# EAGLE design Receiver (EAGLE 7.1.0)
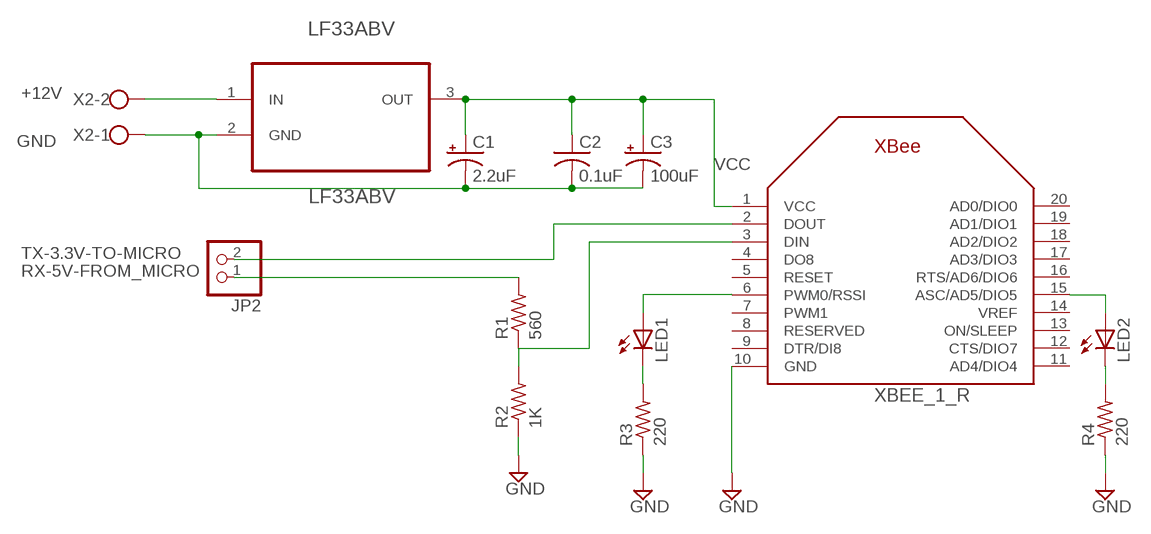
[diagram p0: schematic, sheet 1]

## Parts
C1  2.2uF  CAP_POLPTH2  [CPOL-RADIAL-10UF-25V]
C2  0.1uF  C-US025-024X044  [C025-024X044]
C3  100uF  CAP_POLPTH1  [CPOL-RADIAL-100UF-25V]
JP2  PINHD-1X2  [1X02]
LED1  LED5MM  [LED5MM]
LED2  LED5MM  [LED5MM]
LF33ABV  LF33ABV  [TO254P450X1020X1935-3P]
R1  560  R-US_0207/10  [0207/10]
R2  1K  R-US_0207/10  [0207/10]
R3  220  R-US_0207/10  [0207/10]
R4  220  R-US_0207/10  [0207/10]
X2  W237-102  [W237-102]
XBEE_1_R  XBEE  [XBEE]

## Nets
+12V [power]: LF33ABV.1(IN) X2.2
GND [power]: C1.2(-) C2.2 C3.2(-) LF33ABV.2(GND) R2.1 R3.1 R4.1 X2.1 XBEE_1_R.10(GND)
N$1: R1.1 R2.2 XBEE_1_R.3(DIN)
N$3: LED1.K(C) R3.2
N$5: LED2.A XBEE_1_R.15(ASC/AD5/DIO5)
N$6: LED2.K(C) R4.2
N$7: LED1.A XBEE_1_R.6(PWM0/RSSI)
RX-5V-FROM_MICRO: JP2.1 R1.2
TX-3.3V-TO-MICRO: JP2.2 XBEE_1_R.2(DOUT)
VCC [power]: C1.1(+) C2.1 C3.1(+) LF33ABV.3(OUT) XBEE_1_R.1(VCC)
Unconnected: XBEE_1_R.4(DO8) XBEE_1_R.5(RESET) XBEE_1_R.7(PWM1) XBEE_1_R.8(RESERVED) XBEE_1_R.9(DTR/DI8) XBEE_1_R.11(AD4/DIO4) XBEE_1_R.12(CTS/DIO7) XBEE_1_R.13(ON/SLEEP) XBEE_1_R.14(VREF) XBEE_1_R.16(RTS/AD6/DIO6) XBEE_1_R.17(AD3/DIO3) XBEE_1_R.18(AD2/DIO2) XBEE_1_R.19(AD1/DIO1) XBEE_1_R.20(AD0/DIO0)

## Library data of the parts
C1 C3 = SparkFun-Capacitors:CAP_POL: Capacitor Polarized These are standard SMD and PTH capacitors. Normally 10uF, 47uF, and 100uF in electrolytic and tantalum varieties. Always verify the external diameter of the through hole cap, it varies with capacity, voltage, and manufacturer. The EIA devices should be standard.
C2 = adafruit:C-US: CAPACITOR, American symbol
JP2 = pinhead:PINHD-1X2: PIN HEADER
LED1 LED2 = adafruit:LED: LED OSRAM: - CHIPLED LG R971, LG N971, LY N971, LG Q971, LY Q971, LO R971, LY R971 LH N974, LH R974 LS Q976, LO Q976, LY Q976 LO Q996 - Hyper CHIPLED LW Q18S LB Q993, LB Q99A, LB R99A - SideLED LS A670, LO A670, LY A670, LG A670, LP A670 LB A673, LV A673, LT A673, LW A673 LH A674 LY A675 LS A676, LA A676, LO A676, LY A676, LW A676 LS A679, LY A679, LG A679 - Hyper Micro SIDELED® LS Y876, LA Y876, LO Y876, LY Y876 LT Y87S - SmartLED LW L88C, LW L88S LB L89C, LB L89S, LG L890 LS L89K, LO L89K, LY L89K LS L896, LA L896, LO L896, LY L896 - TOPLED LS T670, LO T670, LY T670, LG T670, LP T670 LSG T670, LSP T670, LSY T670, LOP T670, LYG T670 LG T671, LOG T671, LSG T671 LB T673, LV T673, LT T673, LW T673 LH T674 LS T676, LA T676, LO T676, LY T676, LB T676, LH T676, LSB T676, LW T676 LB T67C, LV T67C, LT T67C, LS T67K, LO T67K, LY T67K, LW E67C LS E67B, LA E67B, LO E67B, LY E67B, LB E67C, LV E67C, LT E67C LW T67C LS T679, LY T679, LG T679 LS T770, LO T770, LY T770, LG T770, LP T770 LB T773, LV T773, LT T773, LW T773 LH T774 LS E675, LA E675, LY E675, LS T675 LS T776, LA T776, LO T776, LY T776, LB T776 LHGB T686 LT T68C, LB T68C - Hyper Mini TOPLED® LB M676 - Mini TOPLED Santana® LG M470 LS M47K, LO M47K, LY M47K Source: http://www.osram.convergy.de/
LF33ABV = ST Microelctronics_By_element14_Batch_1:LF33ABV: Very low drop voltage regulators with inhibit; MPN: LF33ABV; OC_FARNELL: 1087184; OC_NEWARK: 26M0228; PACKAGE: TO-220; SUPPLIER: STMicroelectronics
R1 R2 = adafruit:R-US_: RESISTOR, American symbol
R3 R4 = resistor:R-US_: RESISTOR, American symbol
X2 = con-wago-500:W237-102: WAGO SCREW CLAMP; MPN: 237-102; OC_FARNELL: unknown; OC_NEWARK: 70K9898
XBEE_1_R = adafruit:XBEE

## Net classes
0 signal: width 0.508 mm, drill 0.508 mm, clearance 0.381 mm
1 power: width 0.635 mm, drill 0.508 mm, clearance 0.559 mm

## Board
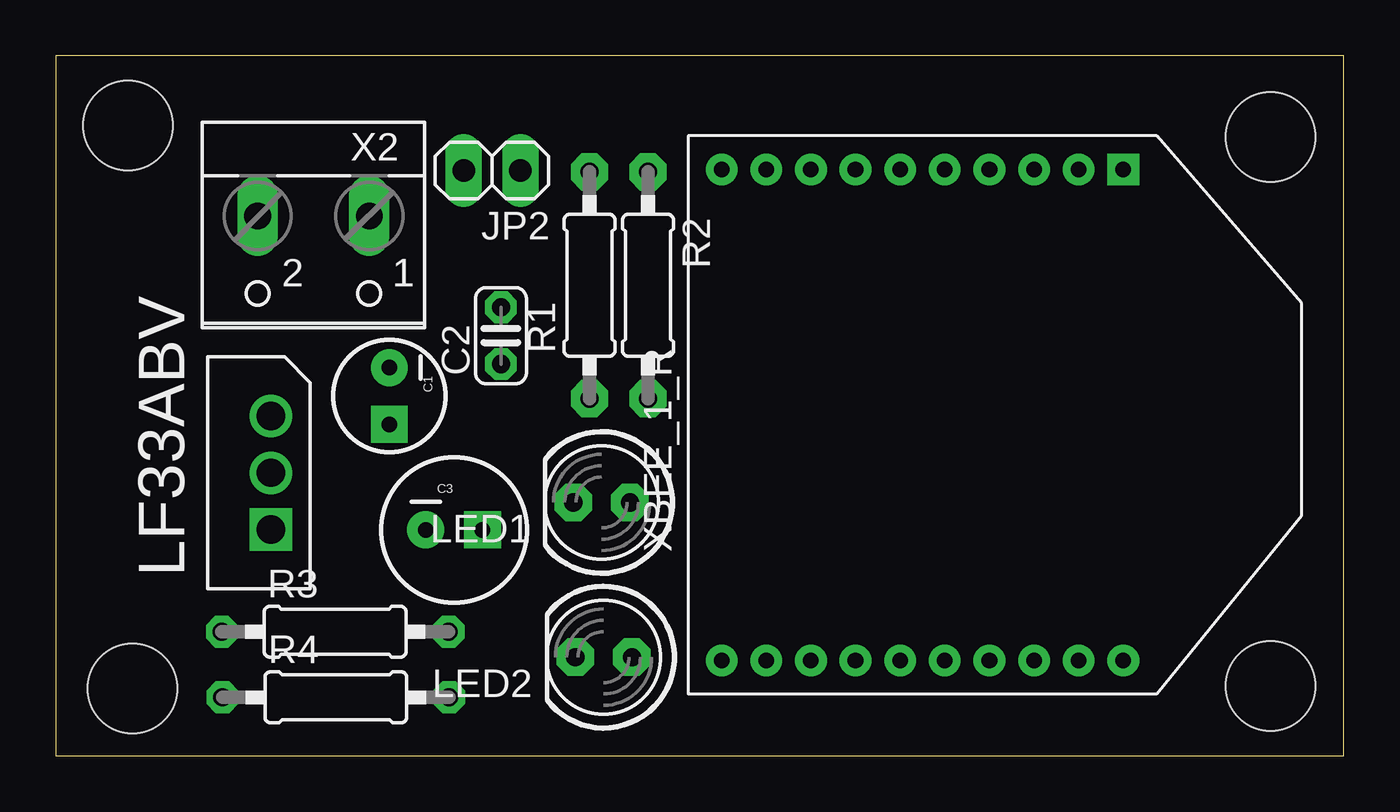
[diagram p1: board, top side]
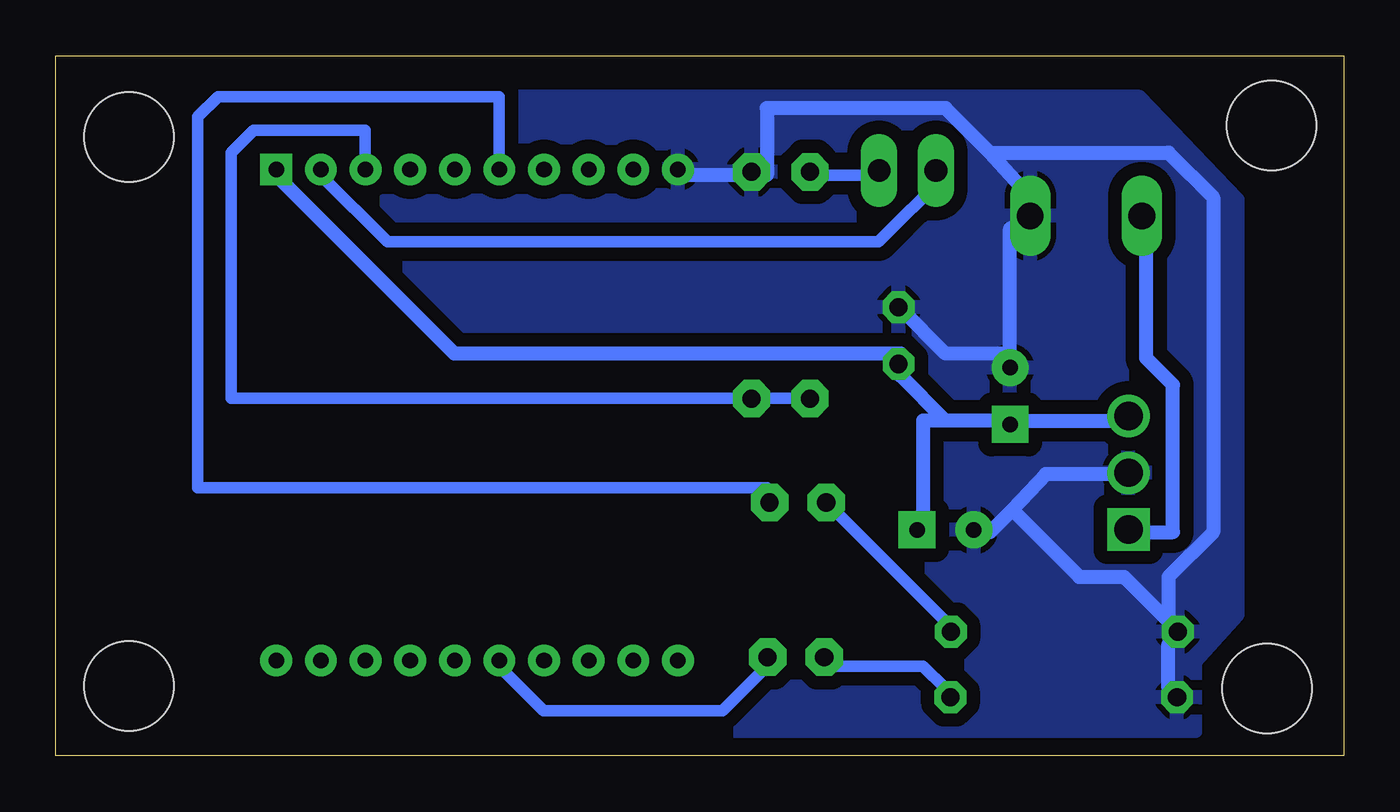
[diagram p2: board, bottom side, seen from below]

Size 57.72 x 31.36 mm. Coordinates in mm from the lower left corner, seen from the top.
Outline: 0,0 57.72,0 57.72,31.36 0,31.36 0,0
Copper layers (1*16): Top 0.035mm / dielectric 1.5mm / Bottom 0.035mm
Design rules "SparkFun": minimum track width 8mil, minimum drill 20mil, track to track 8mil, track to pad 8mil, pad to pad 8mil, via to via 8mil, smd to smd 8mil, copper to edge 8mil, drill to drill 8mil, minimum pad ring 12mil, minimum via ring 10mil, stop-mask expansion 4mil, vias tented up to drill 20mil, thermal gap 10mil
Holes 4 mm at 54.44,27.73 3.24,28.23 3.44,3.02 54.44,3.12

### Footprints (pad centres in the part's own frame; a part is rotated, then mirrored left to right if it is on the bottom)
CPOL-RADIAL-10UF-25V = drill 0.7 pad 1.651 square: 1 1.27,0 | drill 0.7 pad 1.651: 2 -1.27,0
C025-024X044 = drill 0.813 pad 1.422 octagon: 1 -1.27,0; 2 1.27,0
CPOL-RADIAL-100UF-25V = drill 0.7 pad 1.651 square: 1 1.27,0 | drill 0.7 pad 1.651: 2 -1.27,0
1X02 = drill 1.016 long: 1 -1.27,0; 2 1.27,0
LED5MM = drill 0.813 pad 1.676 octagon: A -1.27,0; K 1.27,0
TO254P450X1020X1935-3P = drill 1.27 square: 1 -5.08,-1.092 | drill 1.27: 2 -2.54,-1.092; 3 0,-1.092
0207/10 = drill 0.813 pad 1.676 octagon: 1 -5.08,0; 2 5.08,0
0207/10' = drill 0.813 octagon: 1 -5.08,0; 2 5.08,0
W237-102 = drill 1.194 long: 1 -2.5,-1.27; 2 2.5,-1.27
XBEE = drill 0.7 pad 1.422 square: 1 -11,5.5 | drill 0.7 pad 1.422: 2 -11,3.5; 3 -11,1.5; 4 -11,-0.5; 5 -11,-2.5; 6 -11,-4.5; 7 -11,-6.5; 8 -11,-8.5; 9 -11,-10.5; 10 -11,-12.5; 11 11,-12.5; 12 11,-10.5; 13 11,-8.5; 14 11,-6.5; 15 11,-4.5; 16 11,-2.5; 17 11,-0.5; 18 11,1.5; 19 11,3.5; 20 11,5.5

### Placement (x,y rotation side)
C1  14.95,16.12 270 top
C2  19.95,18.82 90 top
C3  17.85,10.12 0 top
JP2  19.55,26.22 180 top
LED1  24.46,11.35 180 top
LED2  24.55,4.42 180 top
LF33ABV  8.55,15.22 90 top
R1  23.92,21.08 90 top
R2  26.54,21.08 270 top
R3  220  [0207/10']  12.52,5.56 0 top
R4  220  [0207/10']  12.55,2.62 0 top
X2  11.55,22.92 180 top
XBEE_1_R  42.34,15.27 270 top

### Tracks (layer width: path | path; a pad name or v marks a point on that pad's centre or on a via)
+12V
  Bottom 0.635: X2.2 8.85,24.02 8.85,17.82 7.65,16.62 7.65,10.02 8.85,10.02 LF33ABV.1
GND
  Bottom 0.635: R4.1 7.85,3.02 7.85,5.02 R3.1 7.85,6.02 | 14.85,11.02 13.35,12.62 10.15,12.62 LF33ABV.2 | 14.85,11.02 15.85,10.02 C3.2 | 7.85,6.02 9.85,8.02 11.85,8.02 14.85,11.02 | XBEE_1_R.10 29.85,26.02 26.85,26.02 R2.1 25.85,26.02 25.85,29.02 17.85,29.02 15.85,27.02 | 14.95,18.02 17.85,18.02 19.85,20.02 C2.2 | 14.95,18.02 14.95,23.62 X2.1 14.05,25.02 15.85,27.02 | 14.95,18.02 C1.2 | 7.85,6.02 7.85,8.02 5.85,10.02 5.85,25.02 7.85,27.02 15.85,27.02
  pour Bottom (isolate 0.61): 4.75,24.92 9.15,29.52 49.25,29.52 49.25,1.12 6.65,1.12 6.65,4.22 4.75,6.32
N$1
  Bottom 0.508: XBEE_1_R.3 43.85,26.02 43.85,28.02 48.85,28.02 49.85,27.02 49.85,16.02 26.85,16.02 R2.2 25.85,16.02 23.85,16.02 R1.1
N$3
  Bottom 0.508: R3.2 17.85,6.02 22.85,11.02 LED1.K
N$5
  Bottom 0.508: XBEE_1_R.15 37.85,4.02 35.85,2.02 27.85,2.02 25.85,4.02 LED2.A
N$6
  Bottom 0.508: R4.2 17.85,3.02 18.85,4.02 22.85,4.02 LED2.K
N$7
  Bottom 0.508: XBEE_1_R.6 37.85,26.02 37.85,29.52 50.45,29.52 51.35,28.62 51.35,12.02 25.85,12.02 LED1.A
RX-5V-FROM_MICRO
  Bottom 0.508: JP2.1 20.85,26.02 23.85,26.02 R1.2
TX-3.3V-TO-MICRO
  Bottom 0.508: XBEE_1_R.2 45.85,26.02 42.85,23.02 20.85,23.02 17.85,26.02 JP2.2
VCC
  Bottom 0.635: 17.85,15.02 19.85,17.02 C2.1 19.85,18.02 39.85,18.02 47.85,26.02 XBEE_1_R.1 | 14.85,15.02 17.85,15.02 | 17.85,15.02 18.85,15.02 18.85,10.02 C3.1 | 14.85,15.02 9.85,15.02 LF33ABV.3 | 14.85,15.02 C1.1

### Text on the board
Reference: +12V | GND | DOUT | DIN | GND | DIN | VCC | RSSI | DOUT | RESET | 560 | 1K | 0.1uF | XBEE S1 | VOUT | L1 | 2.2uF | GND | VIN | 100uF | 220 | ASS | 220 | L2